# EAGLE schematic PM_proto_4 (EAGLE 9.0.0)
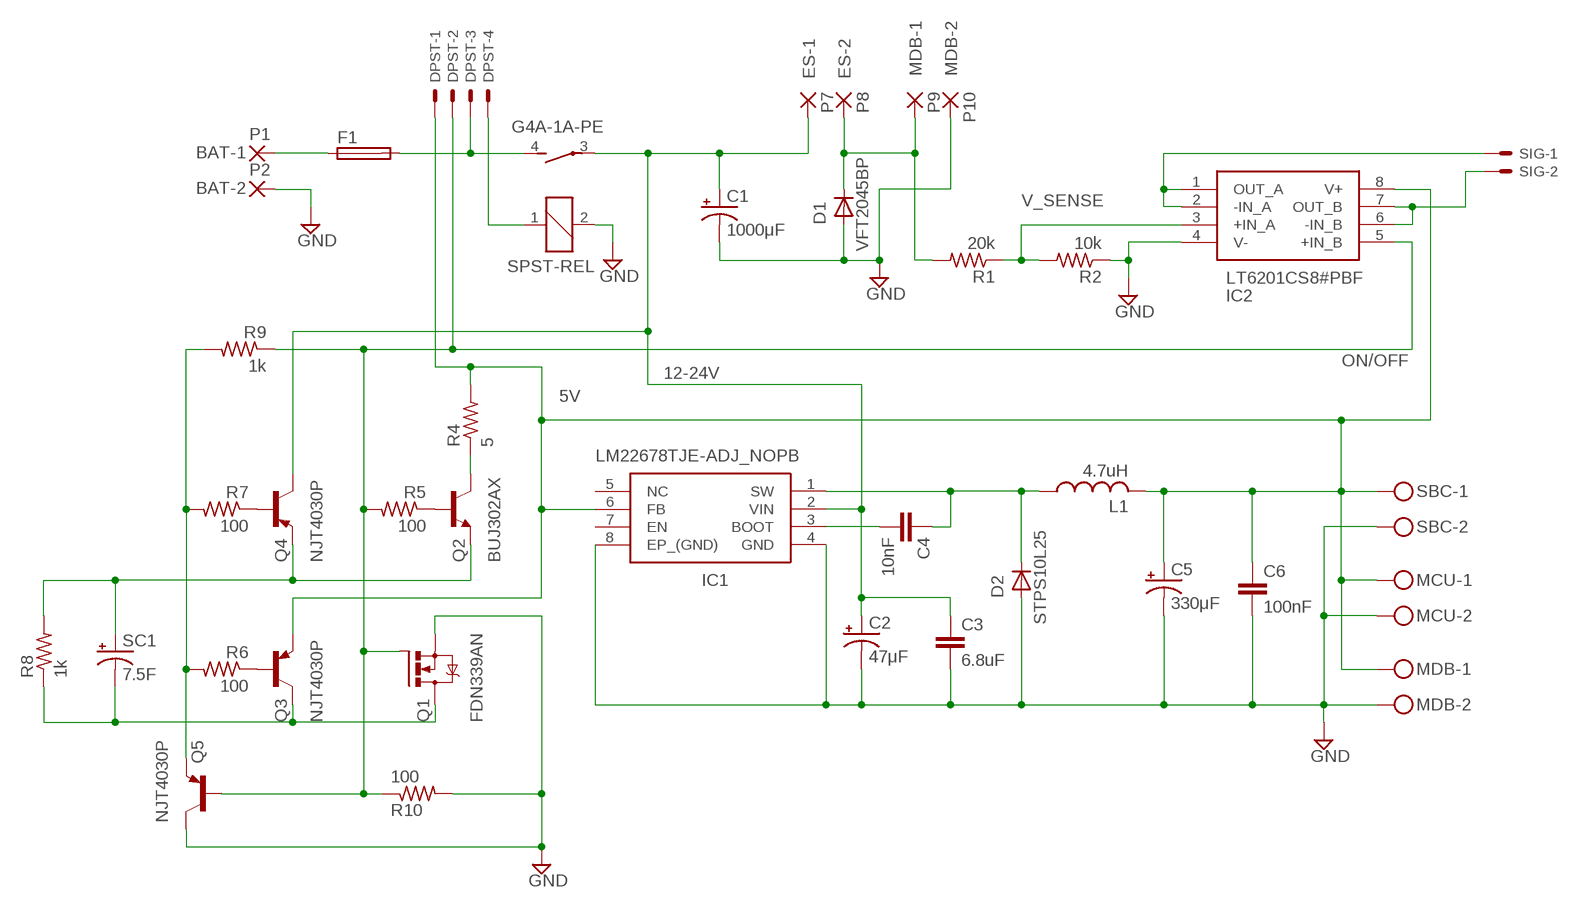
[diagram p0: schematic, sheet 1]

## Parts
C1  1000μF  CPOL-USE7.5-16  [E7,5-16]
C2  47μF  CPOL-USE2,5-6E  [E2,5-6E]
C3  6.8uF  C-EU025-024X044  [C025-024X044]
C4  10nF  C-EU025-024X044  [C025-024X044]
C5  330μF  CPOL-USE2,5-6E  [E2,5-6E]
C6  100nF  C-EU025-024X044  [C025-024X044]
D1  VFT2045BP  [VFT2045BP]
D2  STPS10L25  VFT2045BP  [VFT2045BP]
DPST  JST-XH-04-PIN-LONG-PAD  [JST-XH-04-PACKAGE-LONG-PAD]
F1  0297015FUSE  [0297015HOLDER]
IC1  LM22678TJE-ADJ_NOPB  [LM22678TJEADJNOPB]
IC2  LT6201CS8#PBF  [SOIC127P599X175-8N]
L1  4.7uH  L-US6000-XXX-RC  [6000-XXXX-RC]
MCU  MKDSN1,5/2-5,08  [MKDSN1,5/2-5,08]
MDB  MKDSN1,5/2-5,08  [MKDSN1,5/2-5,08]
P1  BAT-1  1,6/0,8  [1,6/0,8]
P2  BAT-2  1,6/0,8  [1,6/0,8]
P7  ES-1  1,6/0,8  [1,6/0,8]
P8  ES-2  1,6/0,8  [1,6/0,8]
P9  MDB-1  1,6/0,8  [1,6/0,8]
P10  MDB-2  1,6/0,8  [1,6/0,8]
Q1  FDN339AN  IRFZ48Z  [TO220BH]
Q2  BUJ302AX  2N706  [TO18]
Q3  NJT4030P  BC177B-PNP-TO18-EBC  [TO18]
Q4  NJT4030P  BC177B-PNP-TO18-EBC  [TO18]
Q5  NJT4030P  BC177B-PNP-TO18-EBC  [TO18]
R1  20k  R-US_0204/7  [0204/7]
R2  10k  R-US_0204/7  [0204/7]
R4  5  TNP10SC10R0FE  [TNP10SC10R0FE]
R5  100  R-US_0204/7  [0204/7]
R6  100  R-US_0204/7  [0204/7]
R7  100  R-US_0204/7  [0204/7]
R8  1k  R-US_0204/7  [0204/7]
R9  1k  R-US_0204/7  [0204/7]
R10  100  R-US_0204/7  [0204/7]
SBC  MKDSN1,5/2-5,08  [MKDSN1,5/2-5,08]
SC1  7.5F  SCMT32D755MRBB0  [SCMT32D755MRBB0]
SIG  JST-XH-02-PIN-LONG-PAD  [JST-XH-02-PACKAGE-LONG-PAD]
SPST-REL  G4A-1A-PE  [G4A-1A-PE]

## Nets
5V: C5.+ C6.1 DPST.1 IC1.6(FB) IC2.8(V+) L1.2 MCU.1 MDB.1 Q3.1(E) R4.2 SBC.1
12-24V: C1.+ C2.+ C3.1 IC1.2(VIN) P7.1(P) Q4.3(C) SPST-REL.3(P)
BATT_1: F1.1 F1.2 P1.1(P)
BATT_4: D1.1(C) P8.1(P) P9.1(P) R1.2
GND: C1.- C2.- C3.2 C5.- C6.2 D1.2(A) D2.2(A) IC1.4(GND) IC1.8(EP_(GND)) IC2.4(V-) MCU.2 MDB.2 P2.1(P) P10.1(P) Q1.S Q5.3(C) R2.1 R10.2 SBC.2 SPST-REL.2
N$1: C4.2 IC1.3(BOOT)
N$3: Q2.3(C) R4.1
N$4: C4.1 D2.1(C) IC1.1(SW) L1.1
N$5: Q4.2(B) R7.1
N$6: Q2.1(E) Q4.1(E) R8.2 SC1.1(+)
N$7: Q3.2(B) R6.1
N$8: Q2.2(B) R5.1
N$9: Q5.1(E) R6.2 R7.2 R9.2
N$10: Q1.D Q3.3(C) R8.1 SC1.2(-)
N$11: IC2.6(-IN_B) IC2.7(OUT_B) SIG.2
N$12: IC2.1(OUT_A) IC2.2(-IN_A) SIG.1
N$13: DPST.3 F1.3 F1.4 SPST-REL.4(S)
N$14: DPST.4 SPST-REL.1
ON/OFF: DPST.2 IC2.5(+IN_B) Q1.G Q5.2(B) R5.2 R9.1 R10.1
V_SENSE: IC2.3(+IN_A) R1.1 R2.2
Unconnected: IC1.5(NC) IC1.7(EN)

## Library data of the parts
C1 C2 C5 = rcl:CPOL-US: POLARIZED CAPACITOR, American symbol; SPICEPREFIX: C
C3 C4 C6 = rcl:C-EU: CAPACITOR, European symbol; SPICEPREFIX: C
D1 D2 = rasm_parts:VFT2045BP: Trench MOS Barrier Schottky Rectifier. 20A 0.51V.
DPST = Rembrandt Electronics - JST XH Connectors v1-0:JST-XH-04-PIN: JST XH Connector 2 Pin Wire to board connector. Pitch: 2,54 mm, (0.100") Number of pins: 4 Created by Rembrandt Electronics www.rembrandtelectronics.com
F1 = rasm_parts:0297015FUSE: MINI Blade Fuse 0297xxx
IC1 = rasm-other:LM22678TJE-ADJ_NOPB: 5A SIMPLE SWITCHER, Step-Down Voltage Regulator with Precision Enable Source: Datasheet <http://www.ti.com/lit/ds/symlink/lm22678.pdf>; ARROW_PART_NUMBER: LM22678TJE-ADJ/NOPB; ARROW_PRICE/STOCK: https://www.arrow.com/en/products/lm22678tje-adjnopb/texas-instruments; DESCRIPTION: 5A SIMPLE SWITCHER, Step-Down Voltage Regulator with Precision Enable; HEIGHT: 2mm; MANUFACTURER_NAME: Texas Instruments; MANUFACTURER_PART_NUMBER: LM22678TJE-ADJ/NOPB; RS_PART_NUMBER: 1625056; RS_PRICE/STOCK: http://uk.rs-online.com/web/p/products/1625056
IC2 = rasm-other:LT6201CS8#PBF: LT6201CS8#PBF, Dual Operational Amplifier 145MHz Rail-Rail 3 to 12V, 8-Pin SOIC Source: Datasheet <http://cds.linear.com/docs/en/datasheet/62001ff.pdf>; ARROW_PART_NUMBER: LT6201CS8#PBF; ARROW_PRICE/STOCK: https://www.arrow.com/en/products/lt6201cs8pbf/linear-technology; DESCRIPTION: LT6201CS8#PBF, Dual Operational Amplifier 145MHz Rail-Rail 3 to 12V, 8-Pin SOIC; HEIGHT: 1.752mm; MANUFACTURER_NAME: Linear Technology; MANUFACTURER_PART_NUMBER: LT6201CS8#PBF; RS_PART_NUMBER: 5061072P; RS_PRICE/STOCK: http://uk.rs-online.com/web/p/products/5061072P
L1 = rcl:L-US: INDUCTOR, American symbol; SPICEPREFIX: L
MCU MDB SBC = con-phoenix-508:MKDSN1,5/2-5,08: MKDSN 1,5/ 2-5,08 Printklemme Nennstrom: 13,5 A Nennspannung: 250 V Rastermaß: 5,08 mm Polzahl: 2 Anschlussart: Schraubanschluss Montage: Löten Anschlussrichtung Leiter/Platine: 0 ° Artikelnummer: 1729128 Source: http://eshop.phoenixcontact.com .. 1729128.pdf
P1 P2 P7-P10 = wirepad:1,6/0,8: THROUGH-HOLE PAD
Q1 = transistor-power:IRFZ48: N Channel HEXFET® Power MOSFET Logic Level Source: http://www.irf.com/product-info/datasheets/data/irfz48z.pdf
Q2 = transistor:2N706: NPN TRANSISTOR
Q3-Q5 = transistor:*-PNP-: PNP Transistror
R1 R2 R5-R10 = rcl:R-US_: RESISTOR, American symbol; SPICEPREFIX: R
R4 = rasm_parts:TNP10SC10R0FE
SC1 = rasm_parts:SCMT32D755MRBB0: 5.4V 7.5F supercapacitor/ultracapacitor.
SIG = Rembrandt Electronics - JST XH Connectors v1-0:JST-XH-02-PIN: JST XH Connector 2 Pin Wire to board connector. Pitch: 2,54 mm, (0.100") Number of pins: 2 Created by Rembrandt Electronics www.rembrandtelectronics.com
SPST-REL = rasm-other:G4A-1A-PE: SPST-NO 20A power relay. Miniature Single-pole Relay with 80A Surge Current and 20A Switching Current